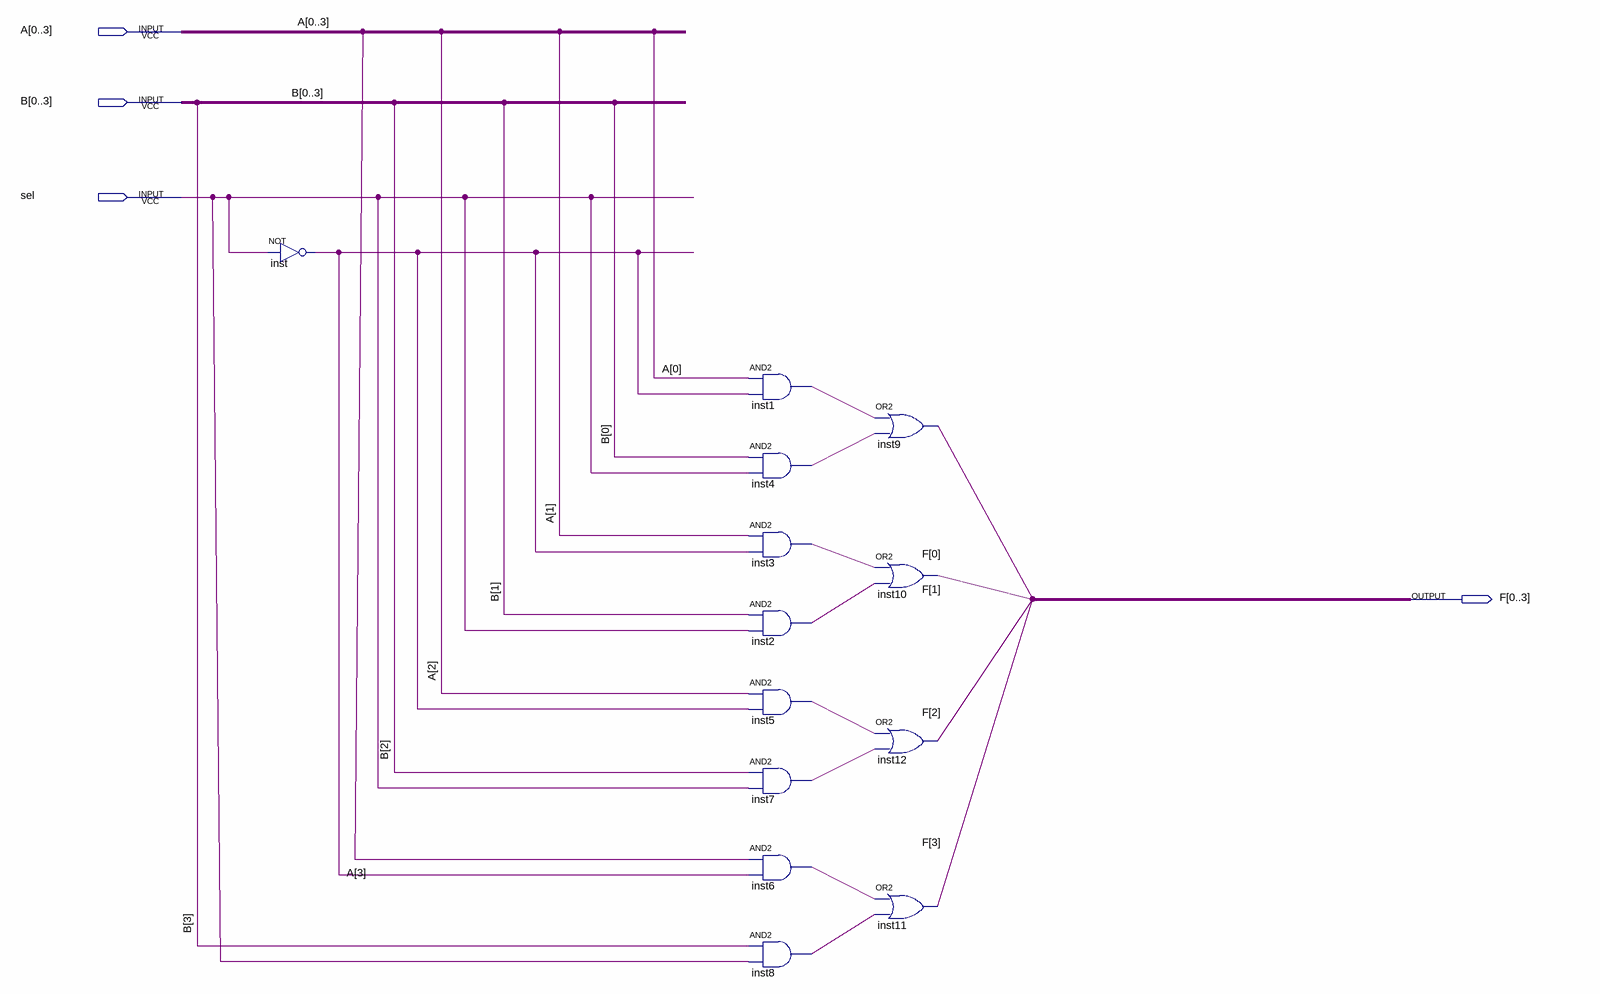
[diagram p0: schematic sheet]
// Quartus schematic Mux4bits.bdf as structural Verilog: 13 symbols, 4 pins
module Mux4bits (
  input  [0:3] A,
  input  [0:3] B,
  input  sel,
  output [0:3] F
);

  wire inst1_out, inst2_out, inst3_out, inst4_out, inst5_out, inst6_out, inst7_out, inst8_out, inst_out;

  not inst (inst_out, sel);
  and inst1 (inst1_out, A[0], inst_out);
  and inst4 (inst4_out, B[0], sel);
  and inst3 (inst3_out, A[1], inst_out);
  and inst2 (inst2_out, B[1], sel);
  and inst5 (inst5_out, A[2], inst_out);
  and inst7 (inst7_out, B[2], sel);
  and inst6 (inst6_out, A[3], inst_out);
  and inst8 (inst8_out, B[3], sel);
  or inst9 (F[0], inst1_out, inst4_out);
  or inst10 (F[1], inst3_out, inst2_out);
  or inst12 (F[2], inst5_out, inst7_out);
  or inst11 (F[3], inst6_out, inst8_out);
endmodule
